# Altium schematic sheet Sheet1.SchDoc
size A4; SheetNumber: 1; SheetTotal: 1
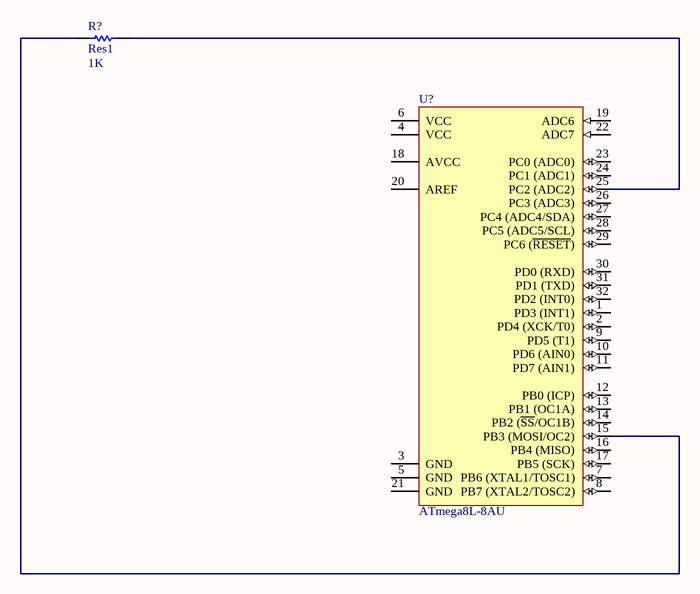
[diagram p0: Sheet1.SchDoc]

## Parts
R?  Res1  value 1K  [AXIAL-0.3]
U?  ATmega8L-8AU  [32A_L]

## Nets
NetR?_1: R?.1 U?.15(PB3_(MOSI/OC2))
NetR?_2: R?.2 U?.25(PC2_(ADC2))

Not connected (* = marked no-connect by the designer): U? 1(PD3_(INT1)) 2(PD4_(XCK/T0)) 3(GND) 4(VCC) 5(GND) 6(VCC) 7(PB6_(XTAL1/TOSC1)) 8(PB7_(XTAL2/TOSC2)) 9(PD5_(T1)) 10(PD6_(AIN0)) 11(PD7_(AIN1)) 12(PB0_(ICP)) 13(PB1_(OC1A)) 14(PB2_(~{SS}/OC1B)) 16(PB4_(MISO)) 17(PB5_(SCK)) 18(AVCC) 19(ADC6) 20(AREF) 21(GND) 22(ADC7) 23(PC0_(ADC0)) 24(PC1_(ADC1)) 26(PC3_(ADC3)) 27(PC4_(ADC4/SDA)) 28(PC5_(ADC5/SCL)) 29(PC6_(~{RESET})) 30(PD0_(RXD)) 31(PD1_(TXD)) 32(PD2_(INT0))

## Library data of the parts
R? = Res1: Resistor; Published: 8-Jun-2000; LatestRevisionDate: 17-Jul-2002; LatestRevisionNote: Re-released for DXP Platform.; PackageReference: AXIAL-0.3; Publisher: Altium Limited; PackageDescription: Axial Device, Thru-Hole; 2 Leads; 0.3 in Pin Spacing
U? = CMP-0095-00569-1: 8-bit AVR Microcontroller, 2.7-5.5V, 8MHz, 8KB Flash, 512 Bytes EEPROM, 1KB SRAM, 32-pin TQFP, Industrial Grade (-40°C to 85°C); PackageVersion: revC, Oct-2010; PackageDescription: 32-Lead, 7x7x1.0 mm Body, 0.8mm Lead Pitch, Thin Profile Plastic Quad Flat Package (TQFP); ComponentLink1URL: http://www.atmel.com/; PackageReference: 32A; ComponentLink2URL: http://www.atmel.com/dyn/resources/prod_documents/doc2486.pdf; ComponentLink1Description: Manufacturer URL; DatasheetVersion: revZ, Feb-2011; ComponentLink3Description: ATmega8(L) Summary; ComponentLink2Description: ATmega8(L); Code_JEDEC: MS-026-ABA; ComponentLink3URL: http://www.atmel.com/dyn/resources/prod_documents/2486S.pdf